# Altium schematic sheet BALANCER.SchDoc
size A4; SheetNumber: 7; SheetTotal: 7
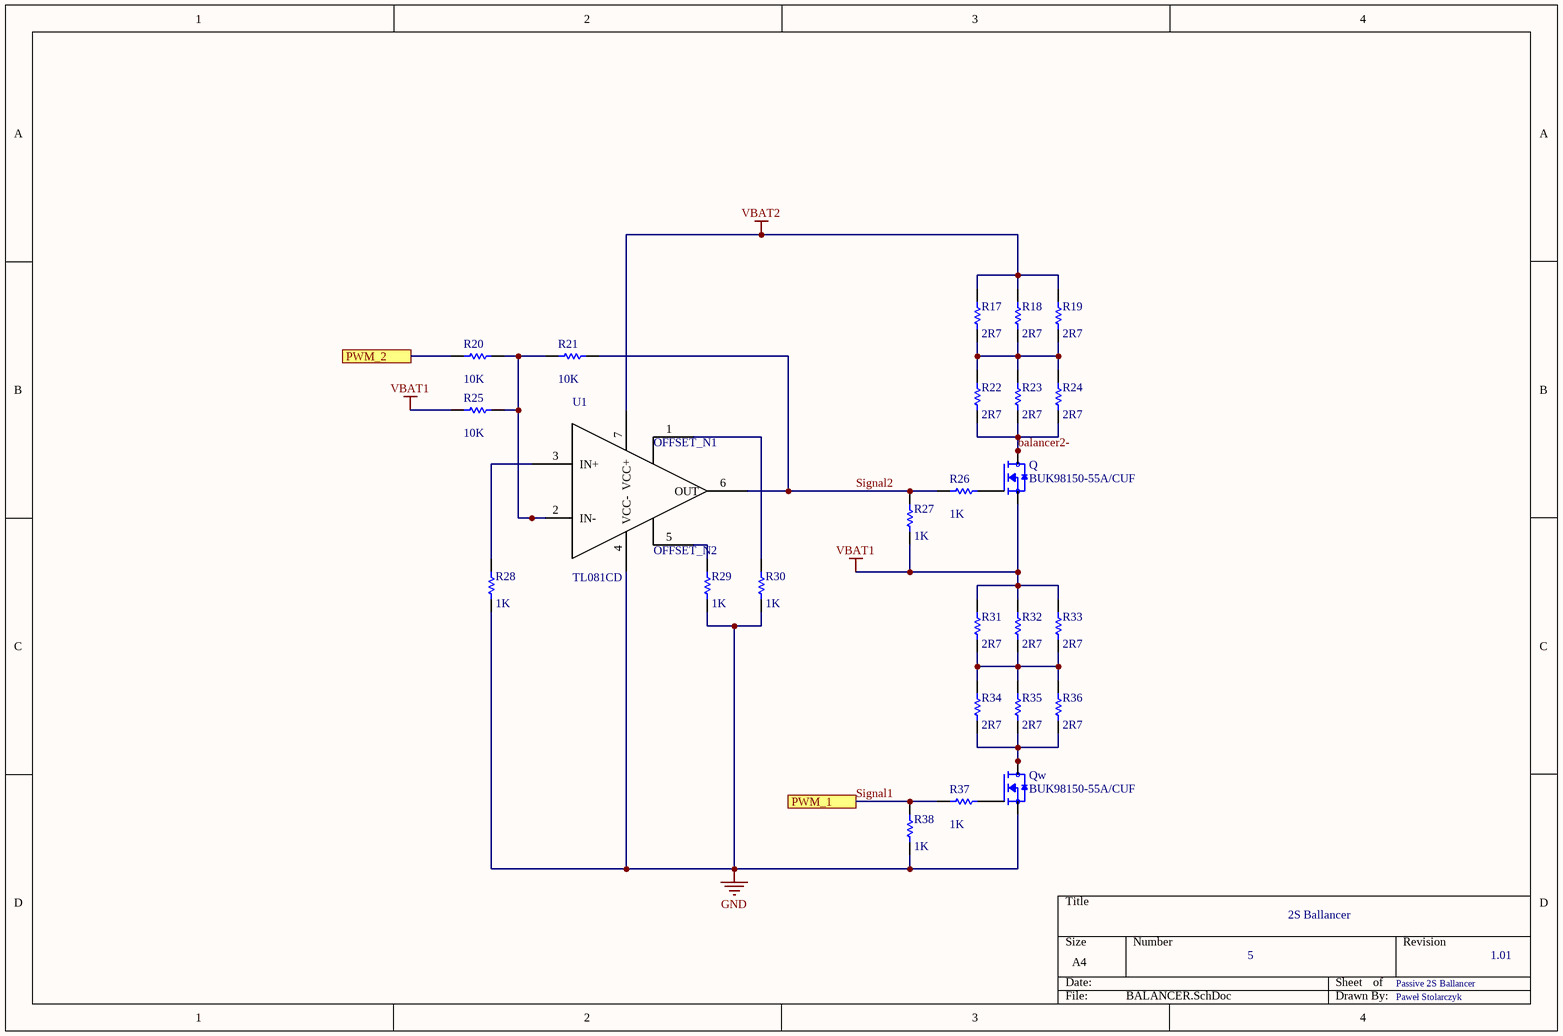
[diagram p0: BALANCER.SchDoc]

## Parts
Q  BUK98150-55A/CUF  [SOT230P700X180-4N]
Qw  BUK98150-55A/CUF  [SOT230P700X180-4N]
R17  value 2R7  [C2512]  (hidden comment: Res1)
R18  value 2R7  [C2512]  (hidden comment: Res1)
R19  value 2R7  [C2512]  (hidden comment: Res1)
R20  value 10K  [0402]  (hidden comment: Res1)
R21  value 10K  [0402]  (hidden comment: Res1)
R22  value 2R7  [C2512]  (hidden comment: Res1)
R23  value 2R7  [C2512]  (hidden comment: Res1)
R24  value 2R7  [C2512]  (hidden comment: Res1)
R25  value 10K  [0402]  (hidden comment: Res1)
R26  value 1K  [0402]  (hidden comment: Res1)
R27  value 1K  [0402]  (hidden comment: Res1)
R28  value 1K  [0402]  (hidden comment: Res1)
R29  value 1K  [0402]  (hidden comment: Res1)
R30  value 1K  [0402]  (hidden comment: Res1)
R31  value 2R7  [C2512]  (hidden comment: Res1)
R32  value 2R7  [C2512]  (hidden comment: Res1)
R33  value 2R7  [C2512]  (hidden comment: Res1)
R34  value 2R7  [C2512]  (hidden comment: Res1)
R35  value 2R7  [C2512]  (hidden comment: Res1)
R36  value 2R7  [C2512]  (hidden comment: Res1)
R37  value 1K  [0402]  (hidden comment: Res1)
R38  value 1K  [0402]  (hidden comment: Res1)
U1  TL081CD  [SOIC127P599X175-8N]

## Ports
PWM_1 (see BMS_SLAVE[2B], MCU[3C]), PWM_2 (see BMS_SLAVE[2B], MCU[3C])

## Nets
GND: Qw.3(S) R28.1 R29.1 R30.1 R38.1 U1.4(VCC-)
VBAT1: Q.3(S) R25.1 R27.1 R31.2 R32.2 R33.2
VBAT2: R17.2 R18.2 R19.2 U1.7(VCC+)
balancer2-: Q.2(D) Q.4(D) R22.1 R23.1 R24.1
PWM_2: R20.1 ; port PWM_2
Signal1: R37.1 R38.2 ; port PWM_1
Signal2: R21.2 R26.1 R27.2 U1.6(OUT)
NetQ_1: Q.1(G) R26.2
NetQw_1: Qw.1(G) R37.2
NetQw_2: Qw.2(D) Qw.4(D) R34.1 R35.1 R36.1
NetR17_1: R17.1 R18.1 R19.1 R22.2 R23.2 R24.2
NetR20_2: R20.2 R21.1 R25.2 U1.2(IN-)
NetR28_2: R28.2 U1.3(IN+)
NetR29_2: R29.2 U1.5(OFFSET_N2)
NetR30_2: R30.2 U1.1(OFFSET_N1)
NetR31_1: R31.1 R32.1 R33.1 R34.2 R35.2 R36.2

## Notes on the sheet
- 2S Ballancer
- 5
- Passive 2S Ballancer
- 1.01
- Paweł Stolarczyk

## Library data of the parts
Q Qw = BUK98150-55A/CUF: N-Channel 55V 5.5A _Tc_ 8W _Tc_ Surface Mount SOT-223; MF: Nexperia USA; Availability: Unavailable; SnapEDA_Link: https://www.snapeda.com/parts/BUK98150-55A/CUF/Nexperia%20USA%20Inc./view-part/2783744/?ref=snap; DigiKey-Purchase-URL: https://snapeda.com/shop?store=DigiKey&id=2783744; MP: BUK98150-55A/CUF; Value: *; Price: None; Package: TO-261-4 Nexperia USA
R17-R38 = Res1: Resistor; Published: 8-Jun-2000; LatestRevisionDate: 17-Jul-2002; LatestRevisionNote: Re-released for DXP Platform.; PackageReference: AXIAL-0.3; Publisher: Altium Limited; PackageDescription: Axial Device, Thru-Hole; 2 Leads; 0.3 in Pin Spacing
U1 = TL081CD: High Slew Rate JFET-Input Operational Amplifier 8-SOIC 0 to 70; MF: Texas Instruments; Package: SOIC-8 Texas Instruments; SnapEDA_Link: https://www.snapeda.com/parts/TL081CD/Texas%20Instruments/view-part/4793911/?ref=snap; MP: TL081CD; Availability: Good; Price: None; Value: *; Purchase-URL: https://pricing.snapeda.com/search/part/TL081CD/?ref=eda